# EAGLE design PS2_board (EAGLE 6.2)
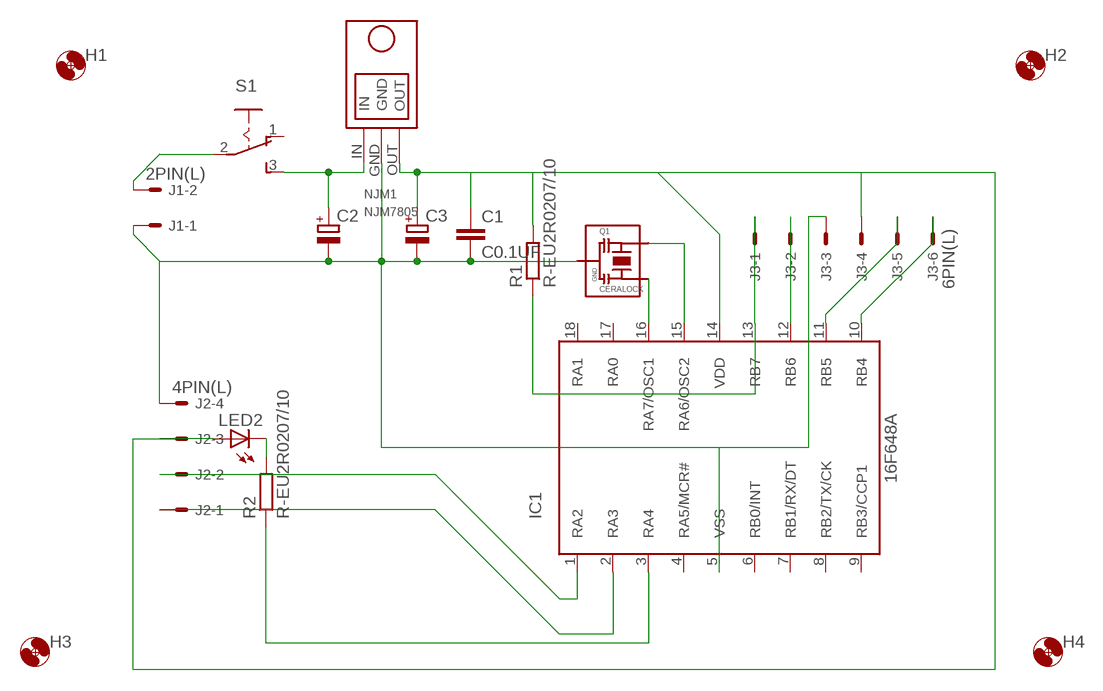
[diagram p0: schematic, sheet 1]

## Parts
C1  C0.1UF  [C0.1UF]
C2  CPOL-EU2-5MM  [E2-5]
C3  CPOL-EU2-5MM  [E2-5]
H1  HOLE3.3M3BOLT  [HOLE3.3]
H2  HOLE3.3M3BOLT  [HOLE3.3]
H3  HOLE3.3M3BOLT  [HOLE3.3]
H4  HOLE3.3M3BOLT  [HOLE3.3]
IC1  16F648A  [18PIN]
J1  2PIN(L)  [2PL]
J2  4PIN(L)  [4PL]
J3  6PIN(L)  [6PL]
LED2  LED5MM  [LED5MM]
NJM1  NJM7805  [NJM7805]
Q1  CERALOCK  [CERALOCK]
R1  R-EU2R0207/10  [0207/10]
R2  R-EU2R0207/10  [0207/10]
S1  SLIDESW  [SLIDESW]

## Nets
N$1: J1.2 S1.2
N$2: C2.+ NJM1.IN S1.3
N$3: C1.1 C3.+ IC1.14(VDD) J2.3 J3.4 LED2.A NJM1.OUT R1.2
N$4: IC1.16(RA7/OSC1) Q1.P$3
N$5: IC1.15(RA6/OSC2) Q1.P$1
N$6: IC1.11(RB5) J3.5
N$7: IC1.12(RB6) J3.2
N$8: IC1.10(RB4) J3.6
N$10: IC1.13(RB7) J3.1 R1.1
N$11: C1.2 C2.- C3.- IC1.5(VSS) J1.1 J2.4 J3.3 NJM1.GND Q1.P$2
N$12: IC1.2(RA3) J2.1
N$13: IC1.1(RA2) J2.2
N$14: IC1.3(RA4) R2.1
N$15: LED2.K(C) R2.2
Unconnected: IC1.4(RA5/MCR#) IC1.6(RB0/INT) IC1.7(RB1/RX/DT) IC1.8(RB2/TX/CK) IC1.9(RB3/CCP1) IC1.17(RA0) IC1.18(RA1) S1.1

## Library data of the parts
C1 = FP-21T for MITS:C0.1UF
C2 C3 = FP-21T for MITS:CPOL-EU2
H1-H4 = FP-21T for MITS:HOLE3.3
IC1 = PIC:16F648A
J1 = connector:2PIN(L)
J2 = connector:4PIN(L)
J3 = connector:6PIN(L)
LED2 = FP-21T for MITS:LED: LED OSRAM: - CHIPLED LG R971, LG N971, LY N971, LG Q971, LY Q971, LO R971, LY R971 LH N974, LH R974 LS Q976, LO Q976, LY Q976 LO Q996 - Hyper CHIPLED LW Q18S LB Q993, LB Q99A, LB R99A - SideLED LS A670, LO A670, LY A670, LG A670, LP A670 LB A673, LV A673, LT A673, LW A673 LH A674 LY A675 LS A676, LA A676, LO A676, LY A676, LW A676 LS A679, LY A679, LG A679 - Hyper Micro SIDELED® LS Y876, LA Y876, LO Y876, LY Y876 LT Y87S - SmartLED LW L88C, LW L88S LB L89C, LB L89S, LG L890 LS L89K, LO L89K, LY L89K LS L896, LA L896, LO L896, LY L896 - TOPLED LS T670, LO T670, LY T670, LG T670, LP T670 LSG T670, LSP T670, LSY T670, LOP T670, LYG T670 LG T671, LOG T671, LSG T671 LB T673, LV T673, LT T673, LW T673 LH T674 LS T676, LA T676, LO T676, LY T676, LB T676, LH T676, LSB T676, LW T676 LB T67C, LV T67C, LT T67C, LS T67K, LO T67K, LY T67K, LW E67C LS E67B, LA E67B, LO E67B, LY E67B, LB E67C, LV E67C, LT E67C LW T67C LS T679, LY T679, LG T679 LS T770, LO T770, LY T770, LG T770, LP T770 LB T773, LV T773, LT T773, LW T773 LH T774 LS E675, LA E675, LY E675, LS T675 LS T776, LA T776, LO T776, LY T776, LB T776 LHGB T686 LT T68C, LB T68C - Hyper Mini TOPLED® LB M676 - Mini TOPLED Santana® LG M470 LS M47K, LO M47K, LY M47K Source: http://www.osram.convergy.de - LUMILED® LXK2-PW12-R00, LXK2-PW12-S00, LXK2-PW14-U00, LXK2-PW14-V00 LXK2-PM12-R00, LXK2-PM12-S00, LXK2-PM14-U00 LXK2-PE12-Q00, LXK2-PE12-R00, LXK2-PE12-S00, LXK2-PE14-T00, LXK2-PE14-U00 LXK2-PB12-K00, LXK2-PB12-L00, LXK2-PB12-M00, LXK2-PB14-N00, LXK2-PB14-P00, LXK2-PB14-Q00 LXK2-PR12-L00, LXK2-PR12-M00, LXK2-PR14-Q00, LXK2-PR14-R00 LXK2-PD12-Q00, LXK2-PD12-R00, LXK2-PD12-S00 LXK2-PH12-R00, LXK2-PH12-S00 LXK2-PL12-P00, LXK2-PL12-Q00, LXK2-PL12-R00 Source: www.luxeon.com
NJM1 = My_NJM7805:NJM7805
Q1 = FP-21T for MITS:CERALOCK: CERALOCK CERAMIC RESONATOR
R1 R2 = FP-21T for MITS:R-EU2
S1 = switch:SLIDESW

## Board
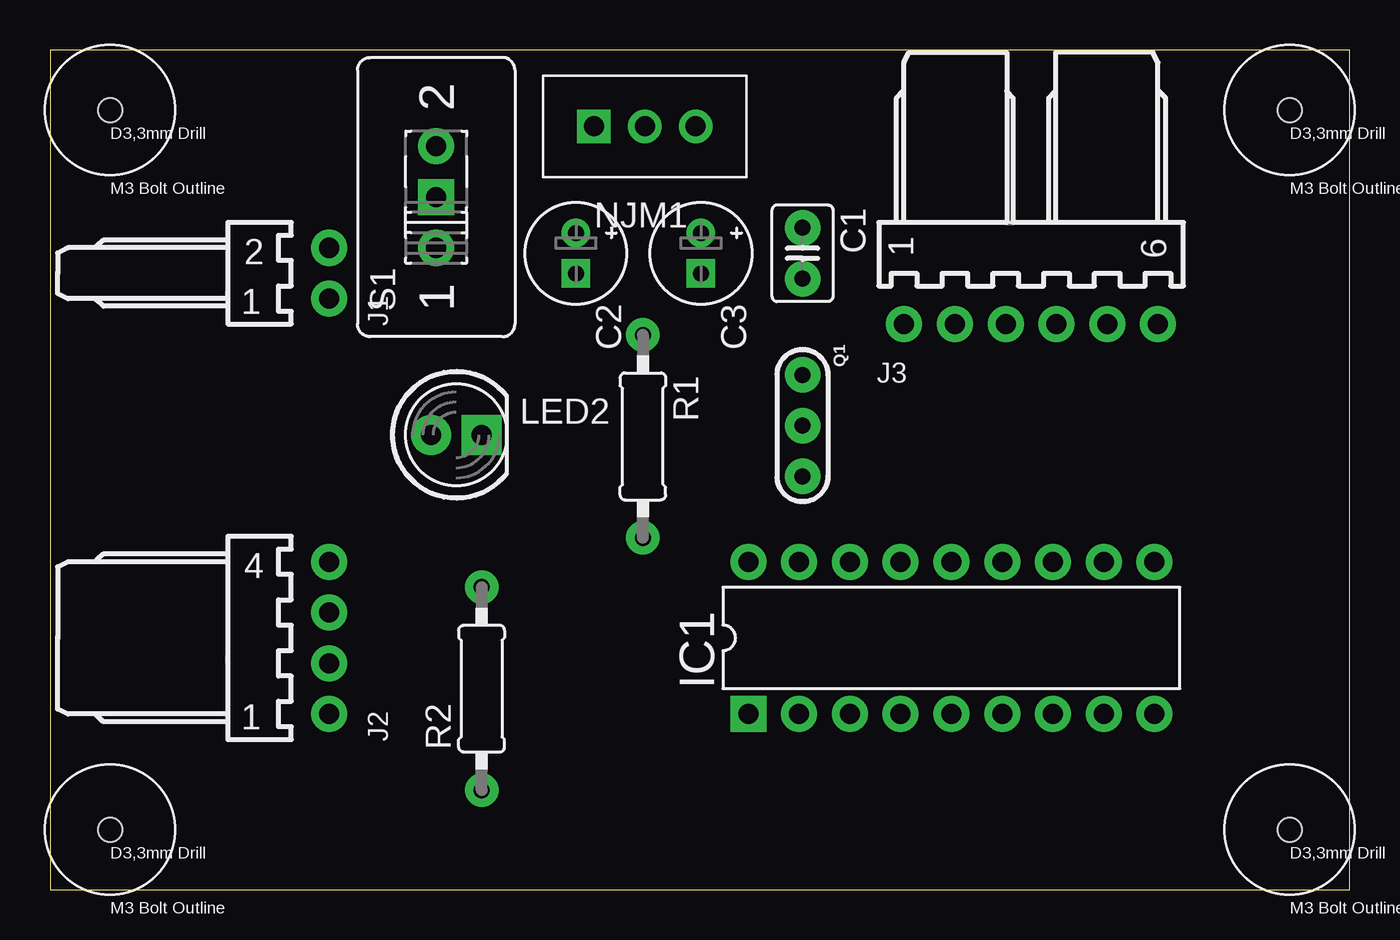
[diagram p1: board, top side]
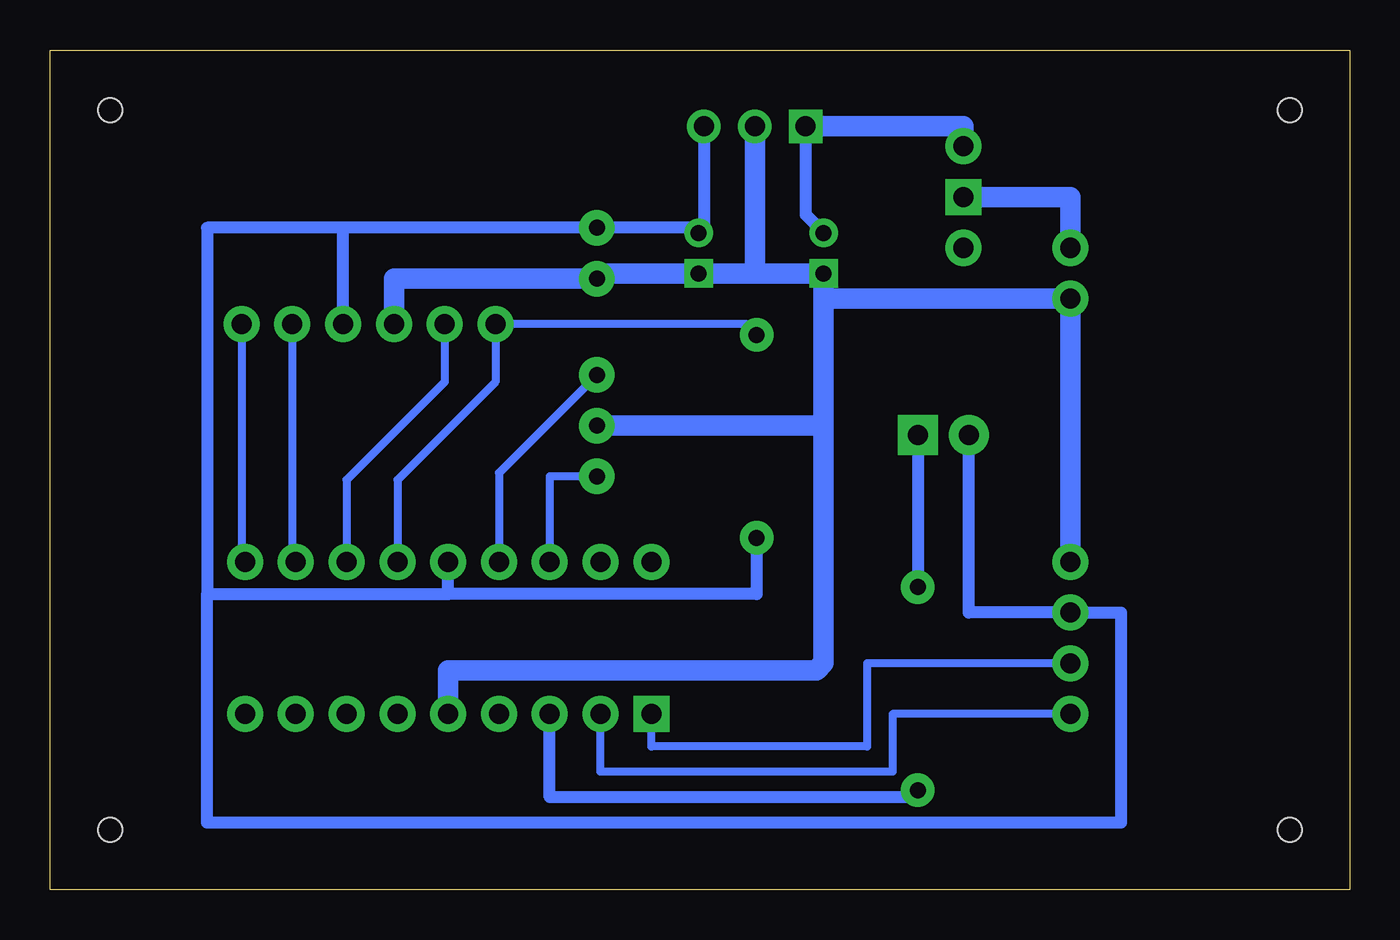
[diagram p2: board, bottom side, seen from below]

Size 65 x 42 mm. Coordinates in mm from the lower left corner, seen from the top.
Outline: 0,0 65,0 65,42 0,42 0,0
Copper layers (1*16): Top 0.035mm / dielectric 1.5mm / Bottom 0.035mm
Design rules: minimum track width 10mil, minimum drill 24mil, track to track 8mil, track to pad 8mil, pad to pad 8mil, via to via 8mil, smd to smd 8mil, copper to edge 40mil, drill to drill 8mil, minimum pad ring 10mil, minimum via ring 8mil, stop-mask expansion 4mil, vias tented up to drill 0mil, thermal gap 10mil

### Footprints (pad centres in the part's own frame; a part is rotated, then mirrored left to right if it is on the bottom)
C0.1UF = drill 0.8 pad 1.778: 1 -1.27,0; 2 1.27,0
E2-5 = drill 0.8 pad 1.422: + -1.016,0 | drill 0.8 pad 1.422 square: - 1.016,0
HOLE3.3 = hole 1.2: 0,0
18PIN = drill 1 pad 1.8 square: 1 -10.16,-3.81 | drill 1 pad 1.8: 2 -7.62,-3.81; 3 -5.08,-3.81; 4 -2.54,-3.81; 5 0,-3.81; 6 2.54,-3.81; 7 5.08,-3.81; 8 7.62,-3.81; 9 10.16,-3.81; 10 10.16,3.81; 11 7.62,3.81; 12 5.08,3.81; 13 2.54,3.81; 14 0,3.81; 15 -2.54,3.81; 16 -5.08,3.81; 17 -7.62,3.81; 18 -10.16,3.81
2PL = drill 1 pad 1.8: 1 1.27,3.81; 2 -1.27,3.81
4PL = drill 1 pad 1.8: 1 3.81,3.81; 2 1.27,3.81; 3 -1.27,3.81; 4 -3.81,3.81
6PL = drill 1 pad 1.8: 1 6.35,3.81; 2 3.81,3.81; 3 1.27,3.81; 4 -1.27,3.81; 5 -3.81,3.81; 6 -6.35,3.81
LED5MM = drill 1 pad 2: A -1.27,0 | drill 1 pad 2 square: K 1.27,0
NJM7805 = drill 1 pad 1.676: GND 0,0; OUT 2.54,0 | drill 1 pad 1.676 square: IN -2.54,0
CERALOCK = drill 0.8 pad 1.778: P$1 -2.54,0; P$2 0,0; P$3 2.54,0
0207/10 = drill 0.8 pad 1.676: 1 -5.08,0; 2 5.08,0
SLIDESW = drill 1 pad 1.8: 1 -2.54,0; 3 2.54,0 | drill 1 pad 1.8 square: 2 0,0

### Placement (x,y rotation side)
C1  37.64,31.83 270 top
C2  26.3,31.83 270 top
C3  32.56,31.83 270 top
H1  3,39 0 top
H2  3,3 0 top
H3  62,3 0 top
H4  62,39 0 top
IC1  45.09,12.59 0 top
J1  10.16,30.83 270 top
J2  10.16,12.59 270 top
J3  49.07,32.1 180 top
LED2  20.32,22.75 0 top
NJM1  29.75,38.18 0 top
Q1  37.64,23.21 270 top
R1  29.66,22.67 270 top
R2  21.59,10.05 90 top
S1  19.32,34.64 90 top

### Tracks (layer width: path | path; a pad name or v marks a point on that pad's centre or on a via)
N$1
  Bottom 1.016: J1.2 13.97,34.64 S1.2
N$2
  Bottom 0.61: NJM1.IN 27.21,33.75 C2.+
  Bottom 1.016: S1.3 19.32,38.18 NJM1.IN
N$3
  Bottom 0.61: NJM1.OUT 32.29,33.12 C3.+ 32.81,33.1 C1.1 50.34,33.1 | 50.34,33.1 57.15,33.1 57.15,14.78 | 57.15,14.78 45.09,14.78 | 45.09,14.78 IC1.14 | R1.2 29.66,14.78 45.09,14.78 | J3.4 50.34,33.1 | 57.15,14.78 57.15,3.35 11.43,3.35 11.43,13.86 J2.3 19.05,13.86 LED2.A
N$4
  Bottom 0.406: Q1.P$3 40.01,20.67 IC1.16
N$5
  Bottom 0.406: Q1.P$1 42.55,20.84 IC1.15
N$6
  Bottom 0.406: J3.5 52.88,16.57 IC1.11
N$7
  Bottom 0.406: J3.2 45.26,25.4 50.16,20.5 IC1.12
N$8
  Bottom 0.406: J3.6 55.42,16.57 IC1.10
N$10
  Bottom 0.406: IC1.13 47.62,20.5 42.72,25.4 J3.1 30.2,28.29 R1.1
N$11
  Bottom 1.016: J2.4 J1.1 26.3,29.56 C2.- | C2.- 29.75,30.81 | 29.75,30.81 C3.- 37.64,30.81 C1.2 47.8,30.56 J3.3 | C2.- 26.3,23.21 | 26.3,23.21 Q1.P$2 | NJM1.GND 29.75,30.81 | IC1.5 45.09,10.97 26.67,10.97 26.3,11.34 26.3,23.21
N$12
  Bottom 0.406: J2.1 22.86,8.78 22.86,5.89 37.47,5.89 IC1.2
N$13
  Bottom 0.406: J2.2 24.13,11.32 24.13,7.16 34.92,7.16 IC1.1
N$14
  Bottom 0.61: R2.1 21.59,4.62 40.01,4.62 IC1.3
N$15
  Bottom 0.61: LED2.K R2.2